# Altium schematic sheet HYDRA_V3_CAMERA.SchDoc
size B; SheetNumber: 1; SheetTotal: 5
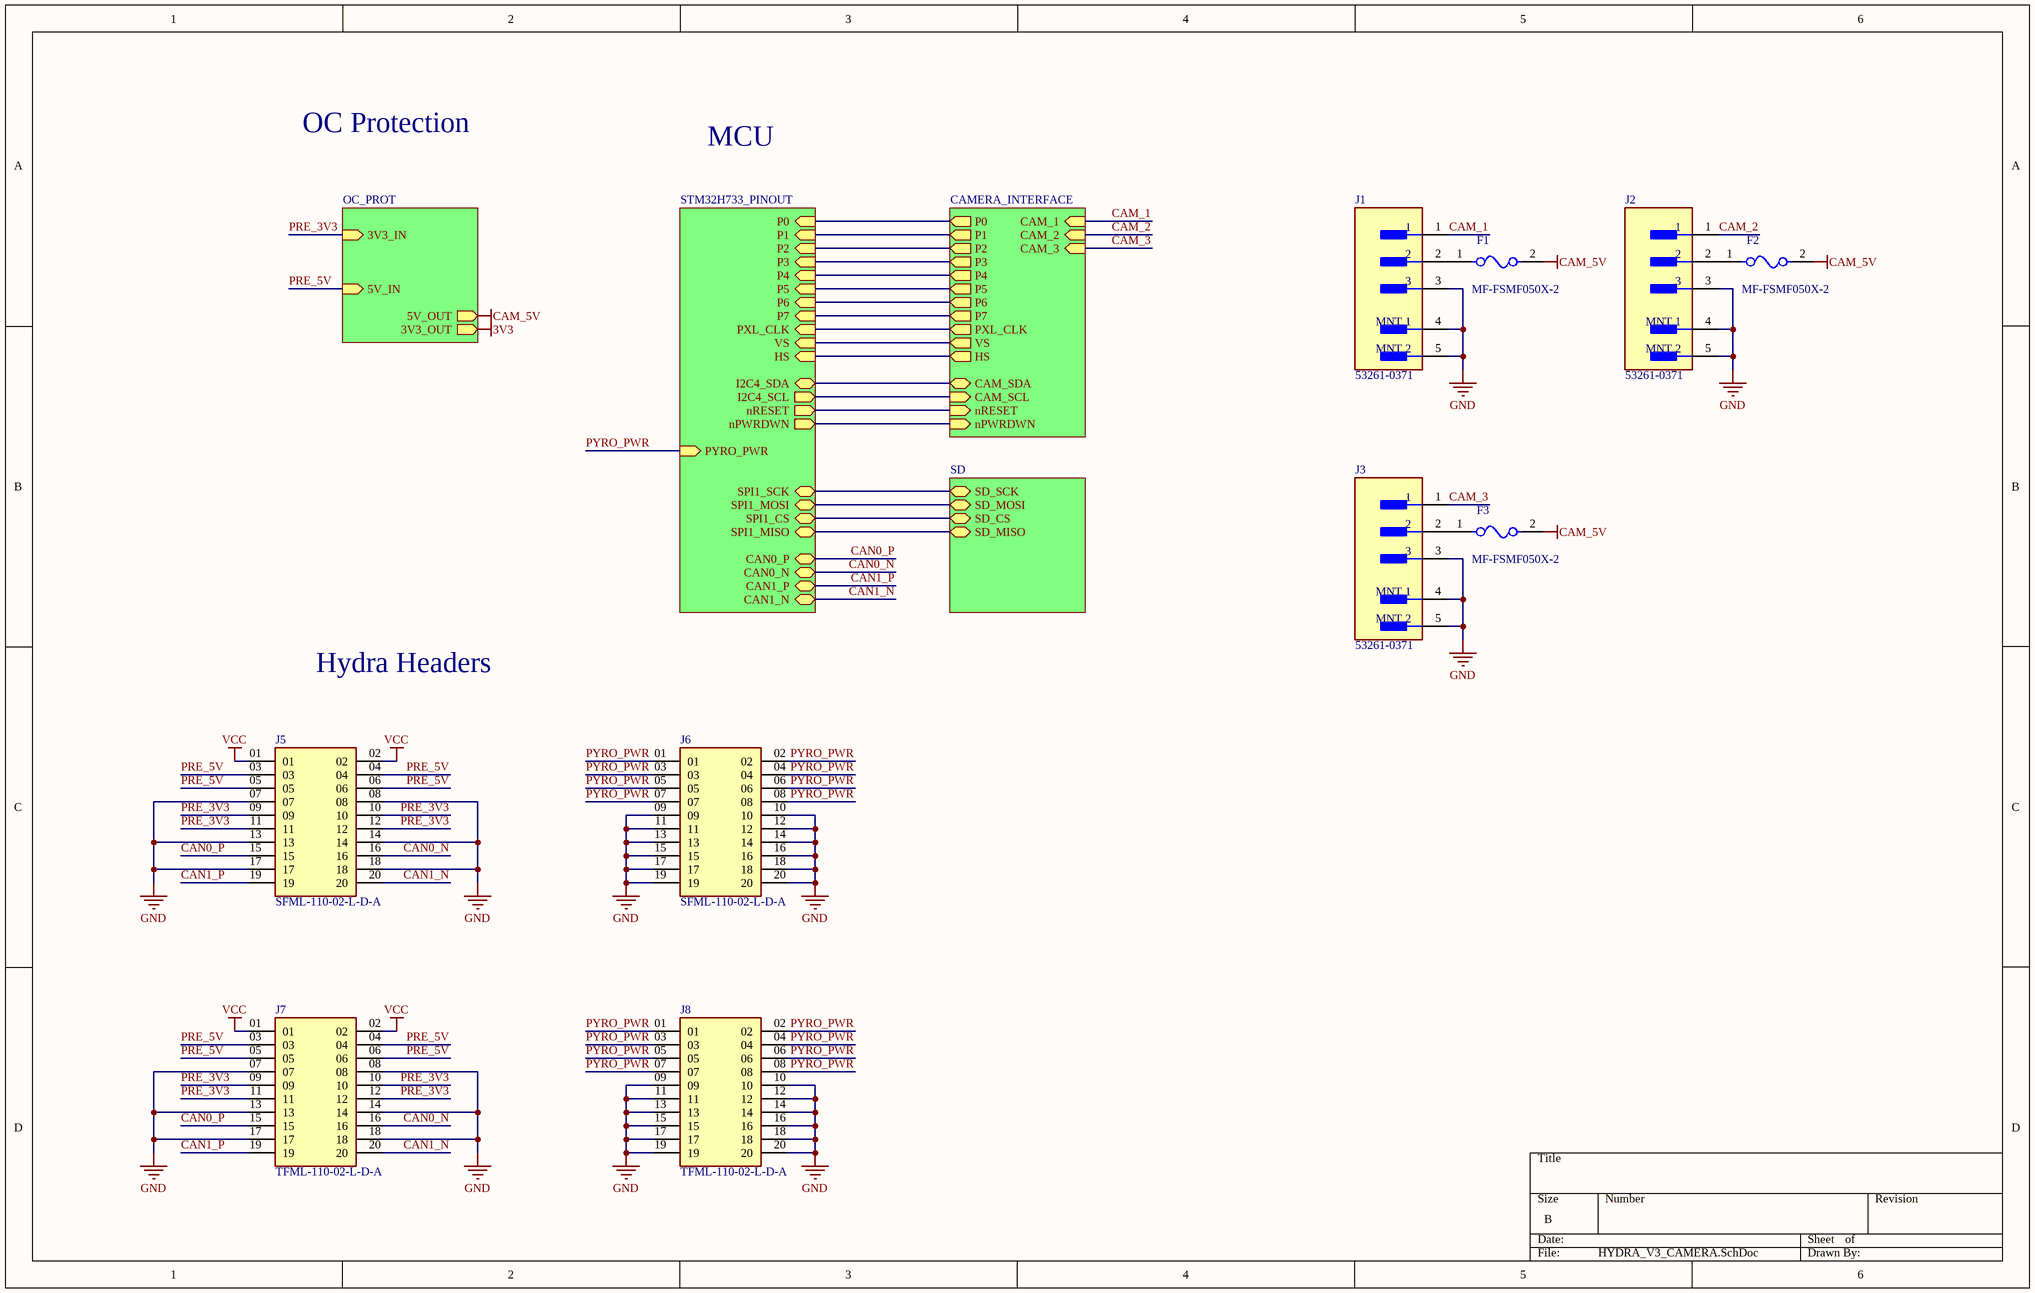
[diagram p0: HYDRA_V3_CAMERA.SchDoc]

## Parts
F1  MF-FSMF050X-2  [FP-MF-FSMF-MFG]
F2  MF-FSMF050X-2  [FP-MF-FSMF-MFG]
F3  MF-FSMF050X-2  [FP-MF-FSMF-MFG]
J1  53261-0371  [FP-53261-0371-MFG]
J2  53261-0371  [FP-53261-0371-MFG]
J3  53261-0371  [FP-53261-0371-MFG]
J5  SFML-110-02-L-D-A  [SFML-110-02-L-D-A-Footprint-1]
J6  SFML-110-02-L-D-A  [SFML-110-02-L-D-A-Footprint-1]
J7  TFML-110-02-L-D-A  [TFML-110-02-L-D-A-Footprint-1]
J8  TFML-110-02-L-D-A  [TFML-110-02-L-D-A-Footprint-1]

## Sub-sheets
CAMERA_INTERFACE = CAMERA_INTERFACE: P0 (out), P1 (out), P2 (out), P3 (out), P4 (out), P5 (out), P6 (out), P7 (out), PXL_CLK (out), VS (out), HS (out), CAM_1 (in), CAM_2 (in), CAM_3 (in), CAM_SDA (bidir), CAM_SCL (in), nRESET (in), nPWRDWN (in)
MCU_PINOUT = STM32H733_PINOUT: CAN0_P (bidir), CAN0_N (bidir), PYRO_PWR (in), CAN1_P (bidir), CAN1_N (bidir), SPI1_SCK (bidir), SPI1_MISO (bidir), SPI1_MOSI (bidir), SPI1_CS (bidir), P0 (in), P1 (in), P2 (in), P3 (in), P4 (in), P5 (in), P6 (in), P7 (in), PXL_CLK (in), VS (in), HS (in), I2C4_SDA (bidir), I2C4_SCL (out), nRESET (out), nPWRDWN (out)
OC_PROT = OC_PROT: 5V_OUT (out), 5V_IN (in), 3V3_IN (in), 3V3_OUT (out)
SD = SD: SD_SCK (bidir), SD_MOSI (bidir), SD_CS (bidir), SD_MISO (bidir)

## Nets
3V3: sheet OC_PROT/3V3_OUT
CAM_5V: F1.2 F2.2 F3.2 ; sheet OC_PROT/5V_OUT
GND: J1.3 J1.4(MNT_1) J1.5(MNT_2) J2.3 J2.4(MNT_1) J2.5(MNT_2) J3.3 J3.4(MNT_1) J3.5(MNT_2) J5.07 J5.08 J5.13 J5.14 J5.17 J5.18 J6.09 J6.10 J6.11 J6.12 J6.13 J6.14 J6.15 J6.16 J6.17 J6.18 J6.19 J6.20 J7.07 J7.08 J7.13 J7.14 J7.17 J7.18 J8.09 J8.10 J8.11 J8.12 J8.13 J8.14 J8.15 J8.16 J8.17 J8.18 J8.19 J8.20
VCC: J5.01 J5.02 J7.01 J7.02
CAM_1: J1.1 ; sheet CAMERA_INTERFACE/CAM_1
CAM_2: J2.1 ; sheet CAMERA_INTERFACE/CAM_2
CAM_3: J3.1 ; sheet CAMERA_INTERFACE/CAM_3
CAN0_N: J5.16 J7.16 ; sheet MCU_PINOUT/CAN0_N
CAN0_P: J5.15 J7.15 ; sheet MCU_PINOUT/CAN0_P
CAN1_N: J5.20 J7.20 ; sheet MCU_PINOUT/CAN1_N
CAN1_P: J5.19 J7.19 ; sheet MCU_PINOUT/CAN1_P
PRE_3V3: J5.09 J5.10 J5.11 J5.12 J7.09 J7.10 J7.11 J7.12 ; sheet OC_PROT/3V3_IN
PRE_5V: J5.03 J5.04 J5.05 J5.06 J7.03 J7.04 J7.05 J7.06 ; sheet OC_PROT/5V_IN
PYRO_PWR: J6.01 J6.02 J6.03 J6.04 J6.05 J6.06 J6.07 J6.08 J8.01 J8.02 J8.03 J8.04 J8.05 J8.06 J8.07 J8.08 ; sheet MCU_PINOUT/PYRO_PWR
NetF1_1: F1.1 J1.2
NetF2_1: F2.1 J2.2
NetF3_1: F3.1 J3.2
(unnamed): sheet MCU_PINOUT/SPI1_SCK, sheet SD/SD_SCK
(unnamed): sheet MCU_PINOUT/SPI1_MISO, sheet SD/SD_MISO
(unnamed): sheet MCU_PINOUT/SPI1_MOSI, sheet SD/SD_MOSI
(unnamed): sheet MCU_PINOUT/SPI1_CS, sheet SD/SD_CS
(unnamed): sheet MCU_PINOUT/P0, sheet CAMERA_INTERFACE/P0
(unnamed): sheet MCU_PINOUT/P1, sheet CAMERA_INTERFACE/P1
(unnamed): sheet MCU_PINOUT/P2, sheet CAMERA_INTERFACE/P2
(unnamed): sheet MCU_PINOUT/P3, sheet CAMERA_INTERFACE/P3
(unnamed): sheet MCU_PINOUT/P4, sheet CAMERA_INTERFACE/P4
(unnamed): sheet MCU_PINOUT/P5, sheet CAMERA_INTERFACE/P5
(unnamed): sheet MCU_PINOUT/P6, sheet CAMERA_INTERFACE/P6
(unnamed): sheet MCU_PINOUT/P7, sheet CAMERA_INTERFACE/P7
(unnamed): sheet MCU_PINOUT/PXL_CLK, sheet CAMERA_INTERFACE/PXL_CLK
(unnamed): sheet MCU_PINOUT/VS, sheet CAMERA_INTERFACE/VS
(unnamed): sheet MCU_PINOUT/HS, sheet CAMERA_INTERFACE/HS
(unnamed): sheet MCU_PINOUT/I2C4_SDA, sheet CAMERA_INTERFACE/CAM_SDA
(unnamed): sheet MCU_PINOUT/I2C4_SCL, sheet CAMERA_INTERFACE/CAM_SCL
(unnamed): sheet MCU_PINOUT/nRESET, sheet CAMERA_INTERFACE/nRESET
(unnamed): sheet MCU_PINOUT/nPWRDWN, sheet CAMERA_INTERFACE/nPWRDWN

## Notes on the sheet
- OC Protection
- MCU
- Hydra Headers

## Library data of the parts
F1-F3 = CMP-07400-000010-1: PTC RESET FUSE 6V 500MA 0603; Manufacturer: Bourns Inc.; Trip Current: 1A; Current Rating: 40A; Hold Current: 0.5A; Resistance: 0.1-0.8Ω; Value: 0.1-0.8Ω; Trip Time: 0.1s; Mouser Description: Resettable Fuses - PPTC 6volts 40amps; Category: Fuse; Digikey Description: PTC RESET FUSE 6V 500MA 0603; Temperature: -40°C to +85°C; Device Class L3: unset; Automotive: No; RoHS: TRUE; Ambient Temperature Range High: +85°C; Device Class L2: PTC Resettable Fuses; Temperature Range High: +85°C; Voltage Rating: 6V; Package: MF-FSMF; Manufacturer Part Number: MF-FSMF050X-2; Ambient Temperature Range Low: -40°C; Lead Free: Yes; ComponentLink2Description: Datasheet; Octopart: https://octopart.com/mf-fsmf050x-2-bourns-10470804; ComponentLink2URL: https://www.bourns.com/docs/Product-Datasheets/mffsmf.pdf; Temperature Range Low: -40°C; Height: 1mm; Device Class L1: Circuit Protection
J1-J3 = CMP-04776-000071-1: CONN HEADER SMD R/A 3POS 1.25MM; Manufacturer: Molex; Number Of Contacts: 3; Conn Orientation: Right Angle; Current Rating: 1A; Voltage Rating: 125V; Conn Gender: Male; Category: Conn; Automotive: No; Footprint Url: https://www.molex.com/pdm_docs/sd/532610371_sd.pdf; Height: 3.6mm; Number Of Rows: 1; Temperature Range Low: -40°C; Package: 0; Octopart: https://octopart.com/53261-0371-molex-655314; ComponentLink2Description: Datasheet; Lead Free: Yes; Ambient Temperature Range Low: -40°C; Device Class L3: unset; Mouser Description: 1.25mm (.049") Pitch PicoBlade Header, Surface Mount, Right Angle, Lead-free, 3 Circuits; Digikey Description: CONN HEADER SMD R/A 3POS 1.25MM; Device Class L2: Headers and Wire Housings; Contact Material: Tin,Nickel; Manufacturer Part Number: 53261-0371; Ambient Temperature Range High: +105°C; ComponentLink2URL: https://www.molex.com/webdocs/datasheets/pdf/en-us/0532610371_PCB_HEADERS.pdf; Pitch: 1.25mm; Temperature: -40°C to +105°C; RoHS: TRUE; Device Class L1: Connectors; Temperature Range High: +105°C
J5 J6 = CMP-002-00076-2: Headers & Wire Housings .050 Tiger Eye High-Reliability Locking Socket Strip
J7 J8 = CMP-002-00077-1: Conn Shrouded Header (4 Sides) HDR 20 POS 1.27mm Solder ST Top Entry SMD TIGER EYE™ Tube